# Altium schematic sheet main.SchDoc
size Letter; CompanyName: Signal Laboratories, Inc.; Address1: 3479 Edison Way; Address2: Menlo Park CA 94025; Address3: +1 (877) 778-8435; Address4: siglabs.com; Revision: 1; SheetNumber: 1; SheetTotal: 1
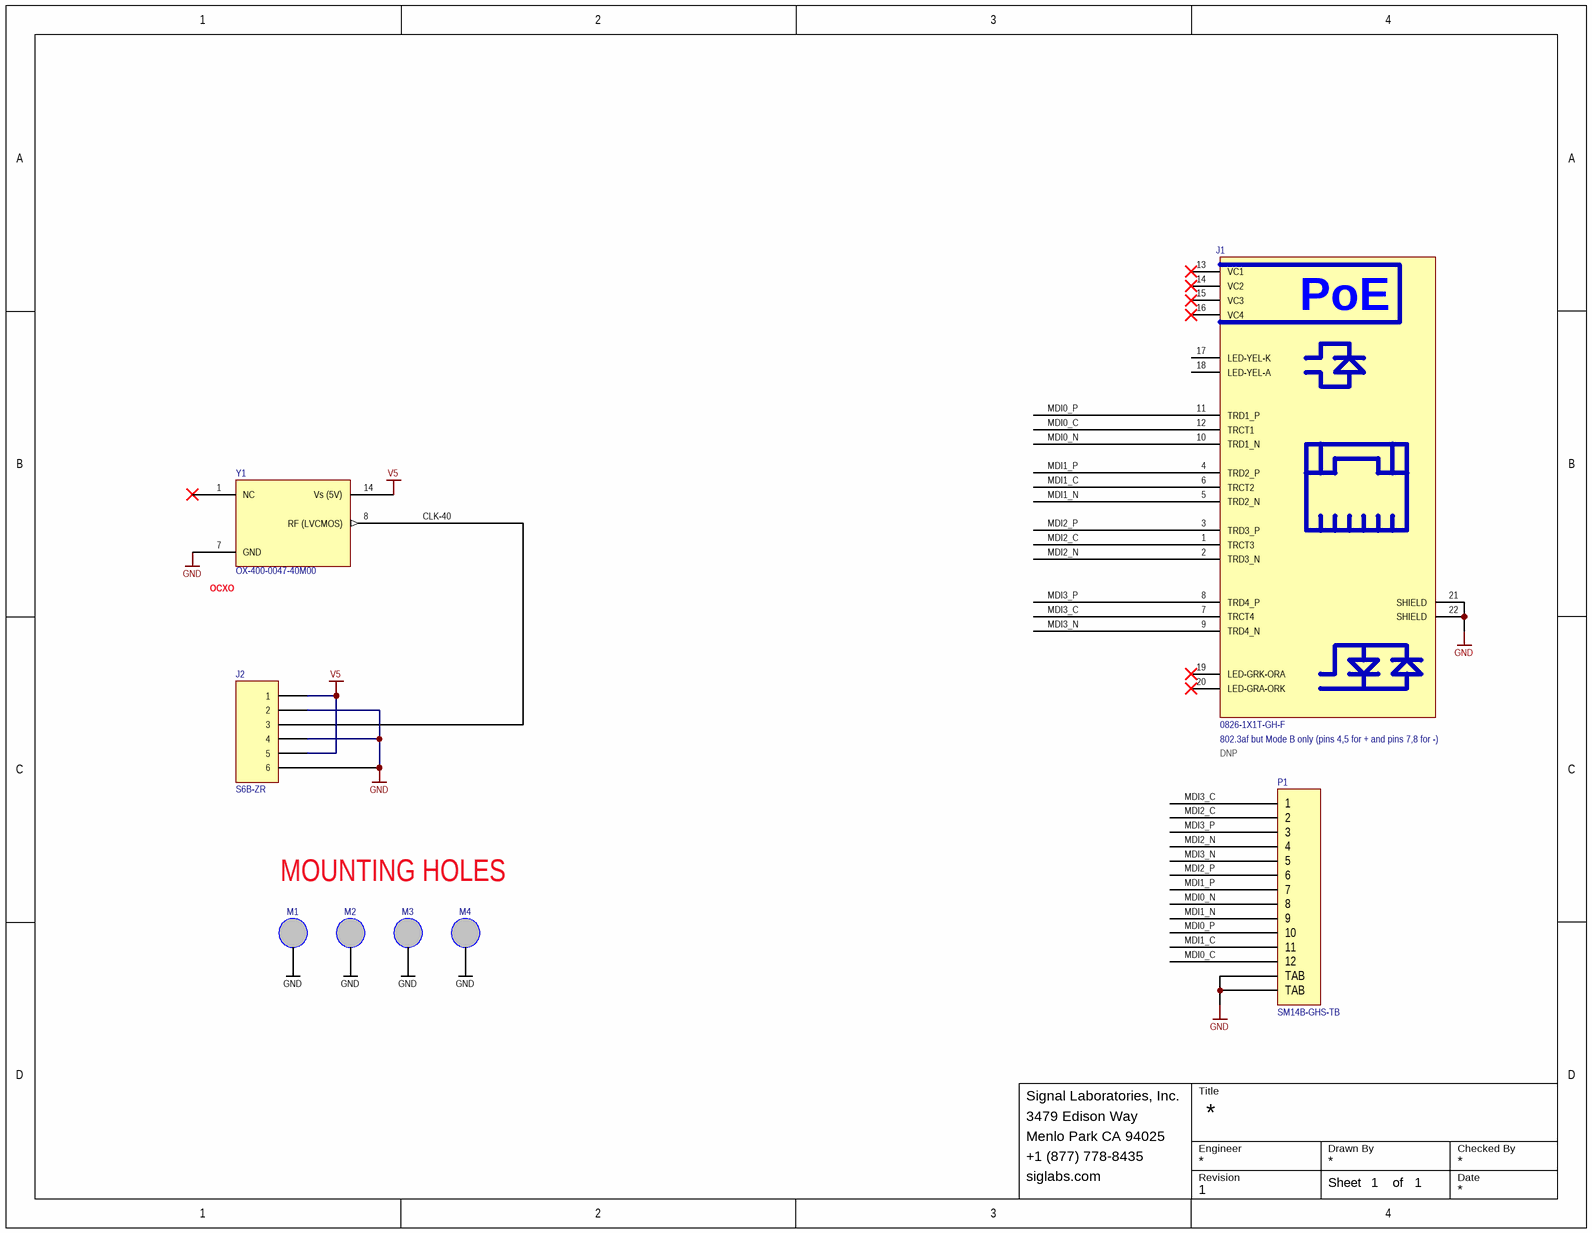
[diagram p0: main.SchDoc]

## Parts
J1  0826-1X1T-GH-F  Do Not Place: DNP  [0826]
J2  S6B-ZR  [S6B-ZR]
M1  MOUNT350  [mount350]  (value not drawn)  (no BOM)
M2  MOUNT350  [mount350]  (value not drawn)  (no BOM)
M3  MOUNT350  [mount350]  (value not drawn)  (no BOM)
M4  MOUNT350  [mount350]  (value not drawn)  (no BOM)
P1  SM14B-GHS-TB  [SM12B-GHS-TBT]
Y1  OX-400-0047-40M00  [G125]

## Nets
GND: J1.21(SHIELD) J1.22(SHIELD) J2.2 J2.4 J2.6 M1.1(GND) M2.1(GND) M3.1(GND) M4.1(GND) P1.13(TAB) P1.14(TAB) Y1.7(GND)
V5: J2.1 J2.5 Y1.14(Vs_(5V))
CLK-40: J2.3 Y1.8(RF_(LVCMOS))
MDI0_C: J1.12(TRCT1) P1.12
MDI0_N: J1.10(TRD1_N) P1.8
MDI0_P: J1.11(TRD1_P) P1.10
MDI1_C: J1.6(TRCT2) P1.11
MDI1_N: J1.5(TRD2_N) P1.9
MDI1_P: J1.4(TRD2_P) P1.7
MDI2_C: J1.1(TRCT3) P1.2
MDI2_N: J1.2(TRD3_N) P1.4
MDI2_P: J1.3(TRD3_P) P1.6
MDI3_C: J1.7(TRCT4) P1.1
MDI3_N: J1.9(TRD4_N) P1.5
MDI3_P: J1.8(TRD4_P) P1.3

Not connected (* = marked no-connect by the designer): J1 13(VC1)* 14(VC2)* 15(VC3)* 16(VC4)* 17(LED-YEL-K) 18(LED-YEL-A) 19(LED-GRK-ORA)* 20(LED-GRA-ORK)*; Y1 1(NC)*

## Notes on the sheet
- (near Y1) OCXO
- 802.3af but Mode B only (pins 4,5 for + and pins 7,8 for -)
- MOUNTING HOLES
- Title
- Engineer
- Revision
- Drawn By
- Checked By
- Date
- Sheet
- of
- (in symbol 0826-1X1T-GH-F) PoE

## Library data of the parts
J1 = 0826-1X1T-GH-F: Gigabit Ethernet 35W PoE MAGJACK; Manufacturer: Bel-Fuse; Manufacturer P/N: 0826-1X1T-GH-F
J2 = S6B-ZR: 1.5mm pitch right angle 6-position; Manufacturer: JST; Manufacturer P/N: S6B-ZR
M1-M4 = M3_HOLE
P1 = BM12B-GHS-TBT: Right Entry Shrouded Connector; 12-position; Manufacturer P/N: SM12B-GHS-TB; Manufacturer: JST
Y1 = OX-400-0047-40M00: Oven Controlled Precision Oscillator, 10MHz; Manufacturer: Vectron; Manufacturer P/N: OX-400-0047-40M00; Do Not Place: *